# Altium schematic sheet mdm3.SchDoc
size A4
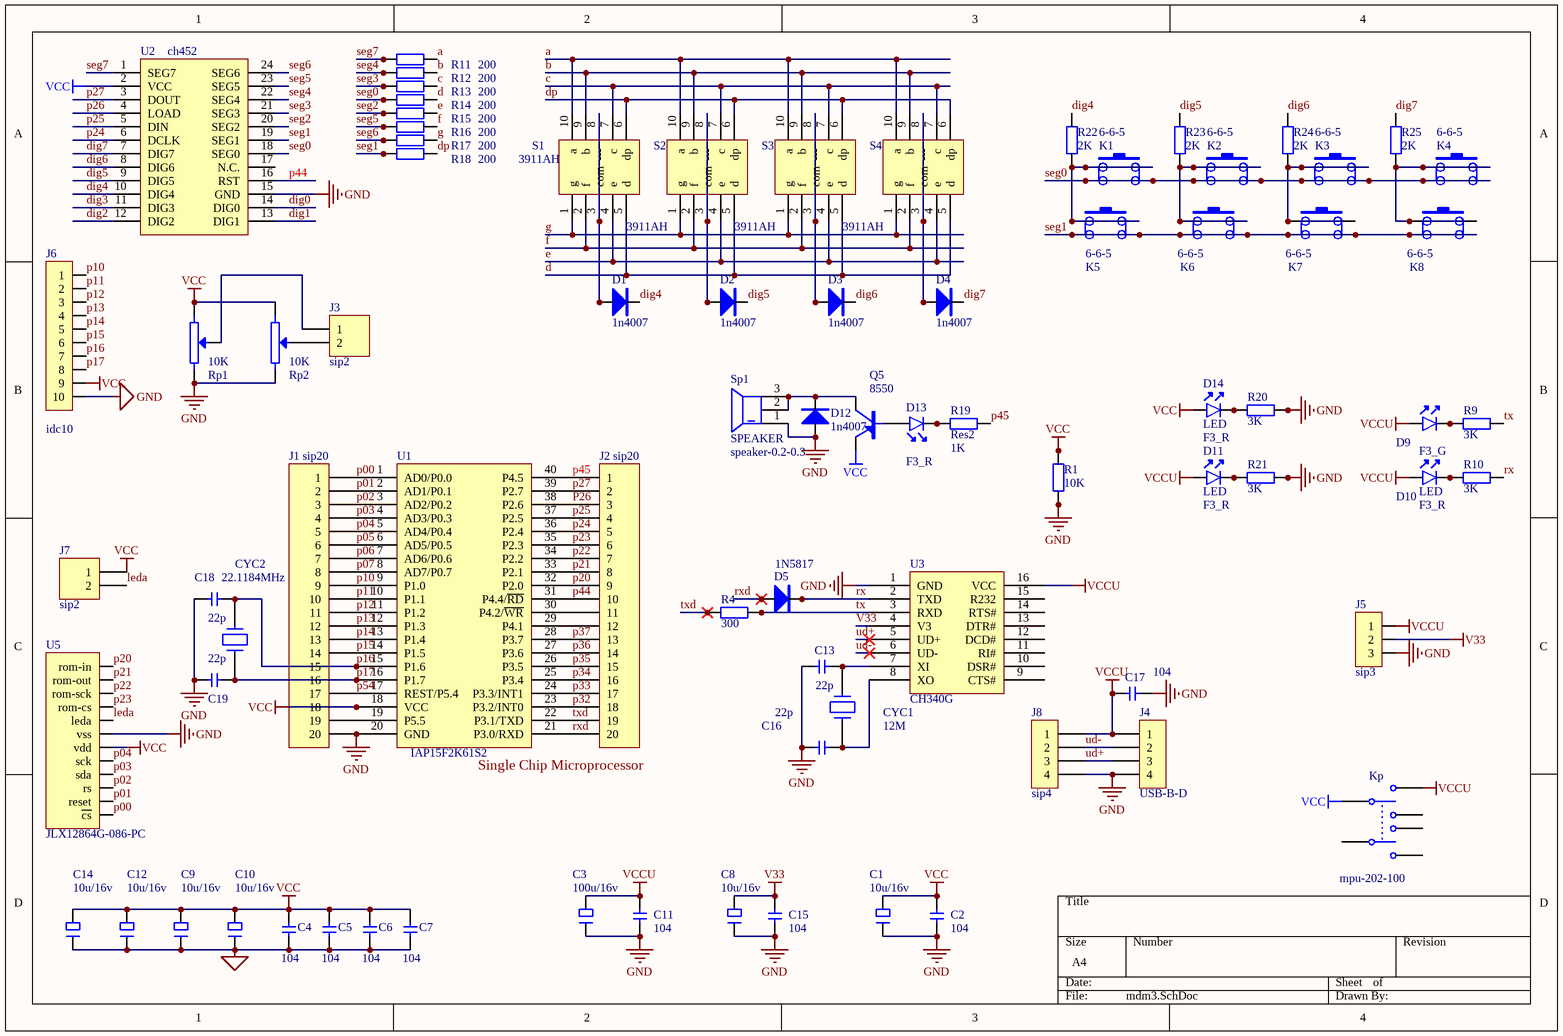
[diagram p0: mdm3.SchDoc]

## Parts
C1  10u/16v  [rb.1/.2]
C2  104  [cap0.1]
C3  value 100u/16v  [rb.1/.2]  (hidden comment: 10u/16v)
C4  104  [cap0.1]
C5  104  [cap0.1]
C6  104  [cap0.1]
C7  104  [cap0.1]
C8  10u/16v  [rb.1/.2]
C9  value 10u/16v  [rb.1/.2]  (hidden comment: 100u/16v)
C10  10u/16v  [rb.1/.2]
C11  104  [cap0.1]
C12  10u/16v  [rb.1/.2]
C13  value 22p  [cap010805]  (hidden comment: 104)
C14  10u/16v  [rb.1/.2]
C15  104  [cap0.1]
C16  value 22p  [cap010805]
C17  104  [cap0.1]
C18  value 22p  [cap010805]
C19  value 22p  [cap010805]
CYC1  value 12M  [cyc-rad]  (hidden comment: 12Mhz)
CYC2  22.1184Mhz  [cyc-rad]
D1  value 1n4007  [smc03]  (hidden comment: 4007)
D2  value 1n4007  [smc03]  (hidden comment: 4007)
D3  value 1n4007  [smc03]  (hidden comment: 4007)
D4  value 1n4007  [smc03]  (hidden comment: 4007)
D5  value 1N5817  [smc03]  (hidden comment: sma03)
D9  value F3_G  [led-3]  (hidden comment: LED)
D10  LED  value F3_R  [led-3]
D11  LED  value F3_R  [led-3]
D12  value 1n4007  [smc03]  (hidden comment: 4007)
D13  value F3_R  [led-3]  (hidden comment: LED)
D14  LED  value F3_R  [led-3]
J1  value sip20  [HDR1X20]  (hidden comment: Header 20)
J2  value sip20  [HDR1X20]  (hidden comment: Header 20)
J3  value sip2  [HDR1X2]  (hidden comment: Header 2)
J4  value USB-B-D  [USB_b]
J5  value sip3  [SIP3]  (hidden comment: CON3)
J6  value idc10  [idc10]  (hidden comment: CON10)
J7  value sip2  [HDR1X2]  (hidden comment: Header 2)
J8  value sip4  [SIP4]  (hidden comment: CON4)
K1  6-6-5  [pb6_6]
K2  6-6-5  [pb6_6]
K3  6-6-5  [pb6_6]
K4  6-6-5  [pb6_6]
K5  6-6-5  [pb6_6]
K6  6-6-5  [pb6_6]
K7  6-6-5  [pb6_6]
K8  6-6-5  [pb6_6]
Kp  value mpu-202-100  [DPDT-6]  (hidden comment: SW-DPDT)
Q5  8550  [to-92a]
R1  value 10K  [a030805]  (hidden comment: Res2)
R4  value 300  [a030805]  (hidden comment: Res2)
R9  value 3K  [a030805]  (hidden comment: Res2)
R10  value 3K  [a030805]  (hidden comment: Res2)
R11  value 200  [a030805]  (hidden comment: Res2)
R12  value 200  [a030805]  (hidden comment: Res2)
R13  value 200  [a030805]  (hidden comment: Res2)
R14  value 200  [a030805]  (hidden comment: Res2)
R15  value 200  [a030805]  (hidden comment: Res2)
R16  value 200  [a030805]  (hidden comment: Res2)
R17  value 200  [a030805]  (hidden comment: Res2)
R18  value 200  [a030805]  (hidden comment: Res2)
R19  Res2  value 1K  [a030805]
R20  value 3K  [a030805]  (hidden comment: Res2)
R21  value 3K  [a030805]  (hidden comment: Res2)
R22  value 2K  [a030805]  (hidden comment: Res2)
R23  value 2K  [a030805]  (hidden comment: Res2)
R24  value 2K  [a030805]  (hidden comment: Res2)
R25  value 2K  [a030805]  (hidden comment: Res2)
Rp1  10k  [VR3296-1]
Rp2  10k  [VR3296-1]
S1  3911AH  [LED10s]
S2  3911AH  [LED10s]
S3  3911AH  [LED10s]
S4  3911AH  [LED10s]
Sp1  SPEAKER  value speaker-0.2-0.3  [sp0.23]
U1  IAP15F2K61S2  [DIP40]
U2  value ch452  [dip24]  (hidden comment: CH451)
U3  CH340G  [SOP-16]
U5  value JLX12864G-086-PC  [jlx12864-1]  (hidden comment: lcd)

## Nets
GND: C1.1 C2.2 C3.1 C4.2 C5.2 C6.2 C7.2 C8.1 C9.1 C10.1 C11.2 C12.1 C13.2 C14.1 C15.2 C16.2 C17.2 C18.2 C19.2 D12.2 D12.4 J1.20 J4.4 J5.3 J6.10 J8.4 R1.2 R1.4 R20.1 R20.3 R21.1 R21.3 Rp1.3 Rp2.3 Sp1.1 U1.20(GND) U2.15(GND) U3.1(GND) U5.6(vss)
V33: C8.2 C15.1 J5.2 U3.4(V3)
VCC: C1.2 C2.1 C4.1 C5.1 C6.1 C7.1 C9.2 C10.2 C12.2 C14.2 D14.1 J1.18 J6.9 J7.1 Kp.2 Q5.1(E) R1.1 R1.3 Rp1.1 Rp2.1 U1.18(VCC) U2.2(VCC) U5.7(vdd)
VCCU: C3.2 C11.1 C17.1 D9.1 D10.1 D11.1 J4.1 J5.1 J8.1 Kp.1 U3.16(VCC)
a: R11.2 R11.4 S1.10(a) S2.10(a) S3.10(a) S4.10(a)
b: R12.2 R12.4 S1.9(b) S2.9(b) S3.9(b) S4.9(b)
c: R13.2 R13.4 S1.7(c) S2.7(c) S3.7(c) S4.7(c)
d: R14.2 R14.4 S1.5(d) S2.5(d) S3.5(d) S4.5(d)
dig0: U2.14(DIG0)
dig1: U2.13(DIG1)
dig2: U2.12(DIG2)
dig3: U2.11(DIG3)
dig4: D1.1 D1.3 R22.1 R22.3 U2.10(DIG4)
dig5: D2.1 D2.3 R23.1 R23.3 U2.9(DIG5)
dig6: D3.1 D3.3 R24.1 R24.3 U2.8(DIG6)
dig7: D4.1 D4.3 R25.1 R25.3 U2.7(DIG7)
dp: R18.2 R18.4 S1.6(dp) S2.6(dp) S3.6(dp) S4.6(dp)
e: R15.2 R15.4 S1.4(e) S2.4(e) S3.4(e) S4.4(e)
f: R16.2 R16.4 S1.2(f) S2.2(f) S3.2(f) S4.2(f)
g: R17.2 R17.4 S1.1(g) S2.1(g) S3.1(g) S4.1(g)
leda: J7.2 U5.5(leda)
p00: J1.1 U1.1(AD0/P0.0) U5.12(~{cs})
p01: J1.2 U1.2(AD1/P0.1) U5.11(reset)
p02: J1.3 U1.3(AD2/P0.2) U5.10(rs)
p03: J1.4 U1.4(AD3/P0.3) U5.9(sda)
p04: J1.5 U1.5(AD4/P0.4) U5.8(sck)
p05: J1.6 U1.6(AD5/P0.5)
p06: J1.7 U1.7(AD6/P0.6)
p07: J1.8 U1.8(AD7/P0.7)
p10: J1.9 J6.1 U1.9(P1.0)
p11: J1.10 J6.2 U1.10(P1.1)
p12: J1.11 J6.3 U1.11(P1.2)
p13: J1.12 J6.4 U1.12(P1.3)
p14: J1.13 J6.5 U1.13(P1.4)
p15: J1.14 J6.6 U1.14(P1.5)
p16: C18.1 CYC2.2 J1.15 J6.7 U1.15(P1.6)
p17: C19.1 CYC2.1 J1.16 J6.8 U1.16(P1.7)
p20: J2.9 U1.32(P2.0) U5.1(rom-in)
p21: J2.8 U1.33(P2.1) U5.2(rom-out)
p22: J2.7 U1.34(P2.2) U5.3(rom-sck)
p23: J2.6 U1.35(P2.3) U5.4(rom-cs)
p24: J2.5 U1.36(P2.4) U2.6(DCLK)
p25: J2.4 U1.37(P2.5) U2.5(DIN)
P26: J2.3 U1.38(P2.6) U2.4(LOAD)
p27: J2.2 U1.39(P2.7) U2.3(DOUT)
p32: J2.18 U1.23(P3.2/INT0)
p33: J2.17 U1.24(P3.3/INT1)
p34: J2.16 U1.25(P3.4)
p35: J2.15 U1.26(P3.5)
p36: J2.14 U1.27(P3.6)
p37: J2.13 U1.28(P3.7)
p44: J2.10 U1.31(P4.4/~{RD}) U2.16(RST)
p45: J2.1 R19.2 R19.4 U1.40(P4.5)
p54: J1.17 U1.17(REST/P5.4)
rx: D5.1 D5.3 R10.1 R10.3 U3.2(TXD)
rxd: D5.2 D5.4 J2.20 U1.21(P3.0/RXD)
seg0: K1.2 K1.3 K2.2 K2.3 K3.2 K3.3 K4.2 K4.3 R14.1 R14.3 U2.18(SEG0)
seg1: K5.2 K5.3 K6.2 K6.3 K7.2 K7.3 K8.2 K8.3 R18.1 R18.3 U2.19(SEG1)
seg2: R15.1 R15.3 U2.20(SEG2)
seg3: R13.1 R13.3 U2.21(SEG3)
seg4: R12.1 R12.3 U2.22(SEG4)
seg5: R16.1 R16.3 U2.23(SEG5)
seg6: R17.1 R17.3 U2.24(SEG6)
seg7: R11.1 R11.3 U2.1(SEG7)
tx: R4.1 R4.3 R9.2 R9.4 U3.3(RXD)
txd: J2.19 R4.2 R4.4 U1.22(P3.1/TXD)
ud+: J4.3 J8.3 U3.5(UD+)
ud-: J4.2 J8.2 U3.6(UD-)
NetC13_1: C13.1 CYC1.2 U3.7(XI)
NetC16_1: C16.1 CYC1.1 U3.8(XO)
NetD1_2: D1.2 D1.4 S1.3(com) S1.8(---)
NetD2_2: D2.2 D2.4 S2.3(com) S2.8(---)
NetD3_2: D3.2 D3.4 S3.3(com) S3.8(---)
NetD4_2: D4.2 D4.4 S4.3(com) S4.8(---)
NetD9_2: D9.2 R9.1 R9.3
NetD10_2: D10.2 R10.2 R10.4
NetD11_2: D11.2 R21.2 R21.4
NetD12_1: D12.1 D12.3 Q5.3(C) Sp1.2 Sp1.3
NetD13_1: D13.1 Q5.2(B)
NetD13_2: D13.2 R19.1 R19.3
NetD14_2: D14.2 R20.2 R20.4
NetJ1_19: J1.19 U1.19(P5.5)
NetJ2_11: J2.11 U1.30(P4.2/~{WR})
NetJ2_12: J2.12 U1.29(P4.1)
NetJ3_1: J3.1 Rp1.2
NetJ3_2: J3.2 Rp2.2
NetK1_1: K1.1 K1.4 K5.1 K5.4 R22.2 R22.4
NetK2_1: K2.1 K2.4 K6.1 K6.4 R23.2 R23.4
NetK3_1: K3.1 K3.4 K7.1 K7.4 R24.2 R24.4
NetK4_1: K4.1 K4.4 K8.1 K8.4 R25.2 R25.4

Not connected (* = marked no-connect by the designer): Kp 3 4 5 6; U2 17(N.C.); U3 9(CTS#) 10(DSR#) 11(RI#) 12(DCD#) 13(DTR#) 14(RTS#) 15(R232)

## Notes on the sheet
- Single Chip Microprocessor

## Library data of the parts
C1 C3 C8-C10 C12 C14 = ELECTRO1: Electrolytic Capacitor
  C1 C8 C10 C12 C14: Value: 10u/16v
C2 C4-C7 C11 C15 C17 = CAP: Capacitor; Value: 104
C13 C16 C18 C19 = CAP
CYC1 CYC2 = CRYSTAL
  CYC2: Value: 22.1184MHz
D1-D4 D12 = DIODE
J1 J2 = Header 20: Header, 20-Pin; LatestRevisionDate: 17-Jul-2002; LatestRevisionNote: Re-released for DXP Platform.; Publisher: Altium Limited
J3 J7 = Header 2: Header, 2-Pin; LatestRevisionDate: 17-Jul-2002; LatestRevisionNote: Re-released for DXP Platform.; Publisher: Altium Limited
J4 J8 = CON4: Connector
J5 = CON3: Connector
J6 = CON10: Connector
K1-K8 = SW-PB2: Value: 6-6-5
Kp = SW-DPDT: Double-Pole, Double-Throw Switch; Published: 24-Mar-1999; LatestRevisionDate: 17-Jul-2002; LatestRevisionNote: Re-released for DXP Platform.; PackageReference: DPDT-6; Publisher: Altium Limited
Q5 = PNP: Value: 8550
R1 R4 = Res22: Resistor; Published: 8-Jun-2000; LatestRevisionDate: 17-Jul-2002; LatestRevisionNote: Re-released for DXP Platform.; PackageReference: AXIAL-0.4; Publisher: Altium Limited
R9-R25 = Res2: Resistor; Published: 8-Jun-2000; LatestRevisionDate: 17-Jul-2002; LatestRevisionNote: Re-released for DXP Platform.; PackageReference: AXIAL-0.4; Publisher: Altium Limited
Rp1 Rp2 = POT2: Value: 10K
S1-S4 = DS1: Value: 3911AH
Sp1 = SPEAKER: SPEAKER sip0.2/0.3
U1 = Component_3: Value: IAP15F2K61S2
U5 = 12 HEADER